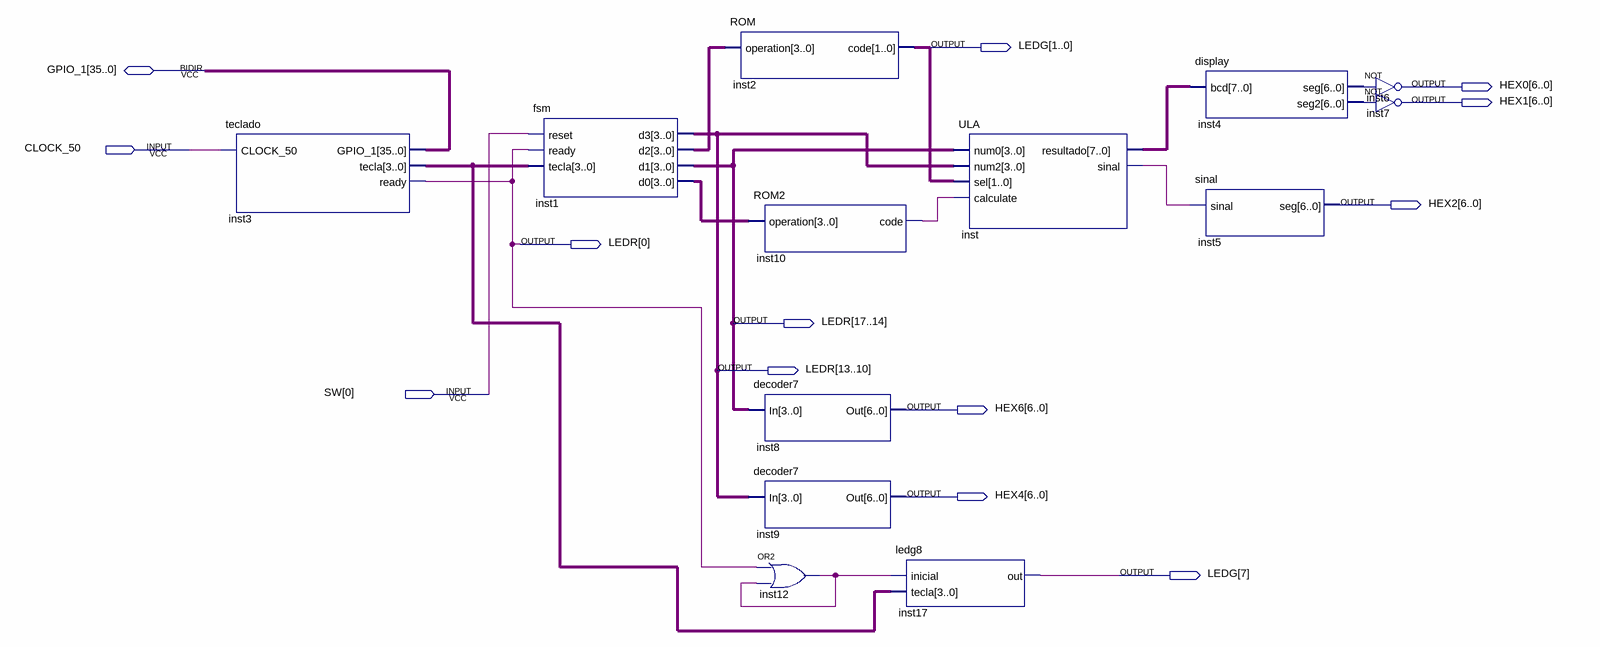
[diagram p0: schematic sheet]
// Quartus schematic top.bdf as structural Verilog: 13 symbols, 13 pins
module top (
  input  CLOCK_50,
  input  [0:0] SW,
  inout  [35:0] GPIO_1,
  output [7:0] LEDG,
  output [6:0] HEX0,
  output [6:0] HEX1,
  output [6:0] HEX2,
  output [17:0] LEDR,
  output [6:0] HEX6,
  output [6:0] HEX4
);

  wire inst10_code, inst12_out, inst_sinal;
  wire [3:0] inst1_d0, inst1_d2, inst3_tecla;
  wire [6:0] inst4_seg, inst4_seg2;
  wire [7:0] inst_resultado;

  teclado inst3 (.CLOCK_50(CLOCK_50), .tecla(inst3_tecla), .ready(LEDR[0]), .GPIO_1(GPIO_1));
  fsm inst1 (
    .reset(SW[0]), .ready(LEDR[0]), .tecla(inst3_tecla), .d3(LEDR[13:10]), .d2(inst1_d2), .d1(LEDR[17:14]),
    .d0(inst1_d0));
  ROM inst2 (.operation(inst1_d2), .code(LEDG[1:0]));
  ROM2 inst10 (.operation(inst1_d0), .code(inst10_code));
  decoder7 inst8 (.In(LEDR[17:14]), .Out(HEX6));
  decoder7 inst9 (.In(LEDR[13:10]), .Out(HEX4));
  or inst12 (inst12_out, LEDR[0], inst12_out);
  ledg8 inst17 (.inicial(inst12_out), .tecla(inst3_tecla), .out(LEDG[7]));
  ULA inst (
    .num0(LEDR[17:14]), .num2(LEDR[13:10]), .sel(LEDG[1:0]), .calculate(inst10_code),
    .resultado(inst_resultado), .sinal(inst_sinal));
  display inst4 (.bcd(inst_resultado), .seg(inst4_seg), .seg2(inst4_seg2));
  sinal inst5 (.sinal(inst_sinal), .seg(HEX2));
  assign HEX0 = ~inst4_seg;  // NOT inst6, 7 bits wide
  assign HEX1 = ~inst4_seg2;  // NOT inst7, 7 bits wide
endmodule
